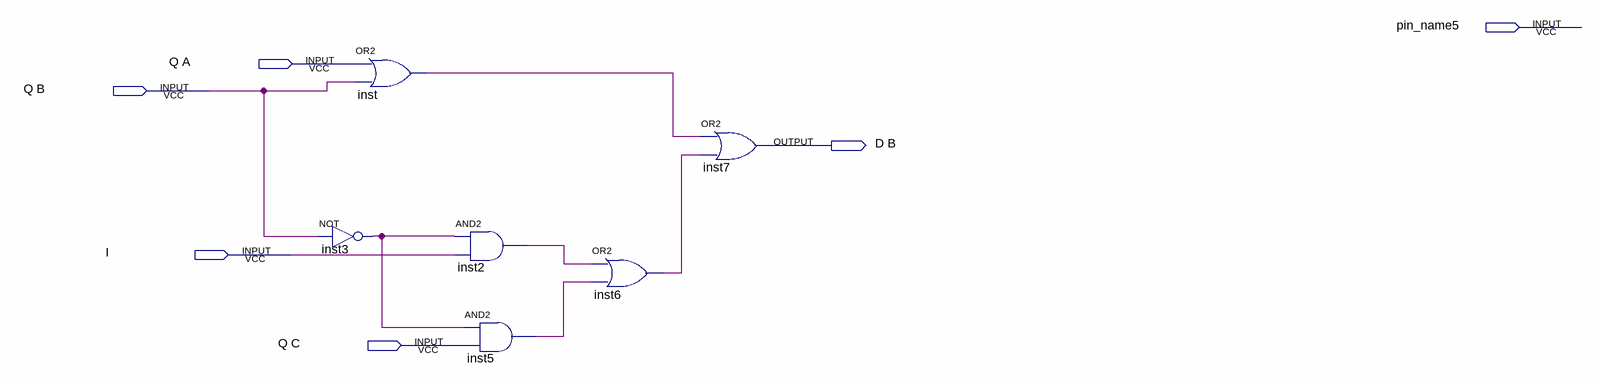
[diagram p0: schematic sheet]
// Quartus schematic autolights.bdf as structural Verilog: 6 symbols, 6 pins
module autolights (
  input  pin_name5,
  input  \Q_A ,
  input  \Q_B ,
  input  I,
  input  \Q_C ,
  output \D_B 
);

  wire inst2_out, inst3_out, inst5_out, inst6_out, inst_out;

  not inst3 (inst3_out, \Q_B );
  or inst (inst_out, \Q_A , \Q_B );
  and inst2 (inst2_out, inst3_out, I);
  and inst5 (inst5_out, inst3_out, \Q_C );
  or inst6 (inst6_out, inst2_out, inst5_out);
  or inst7 (\D_B , inst_out, inst6_out);
endmodule
